# EAGLE design triple8_v3 (EAGLE 5.06)
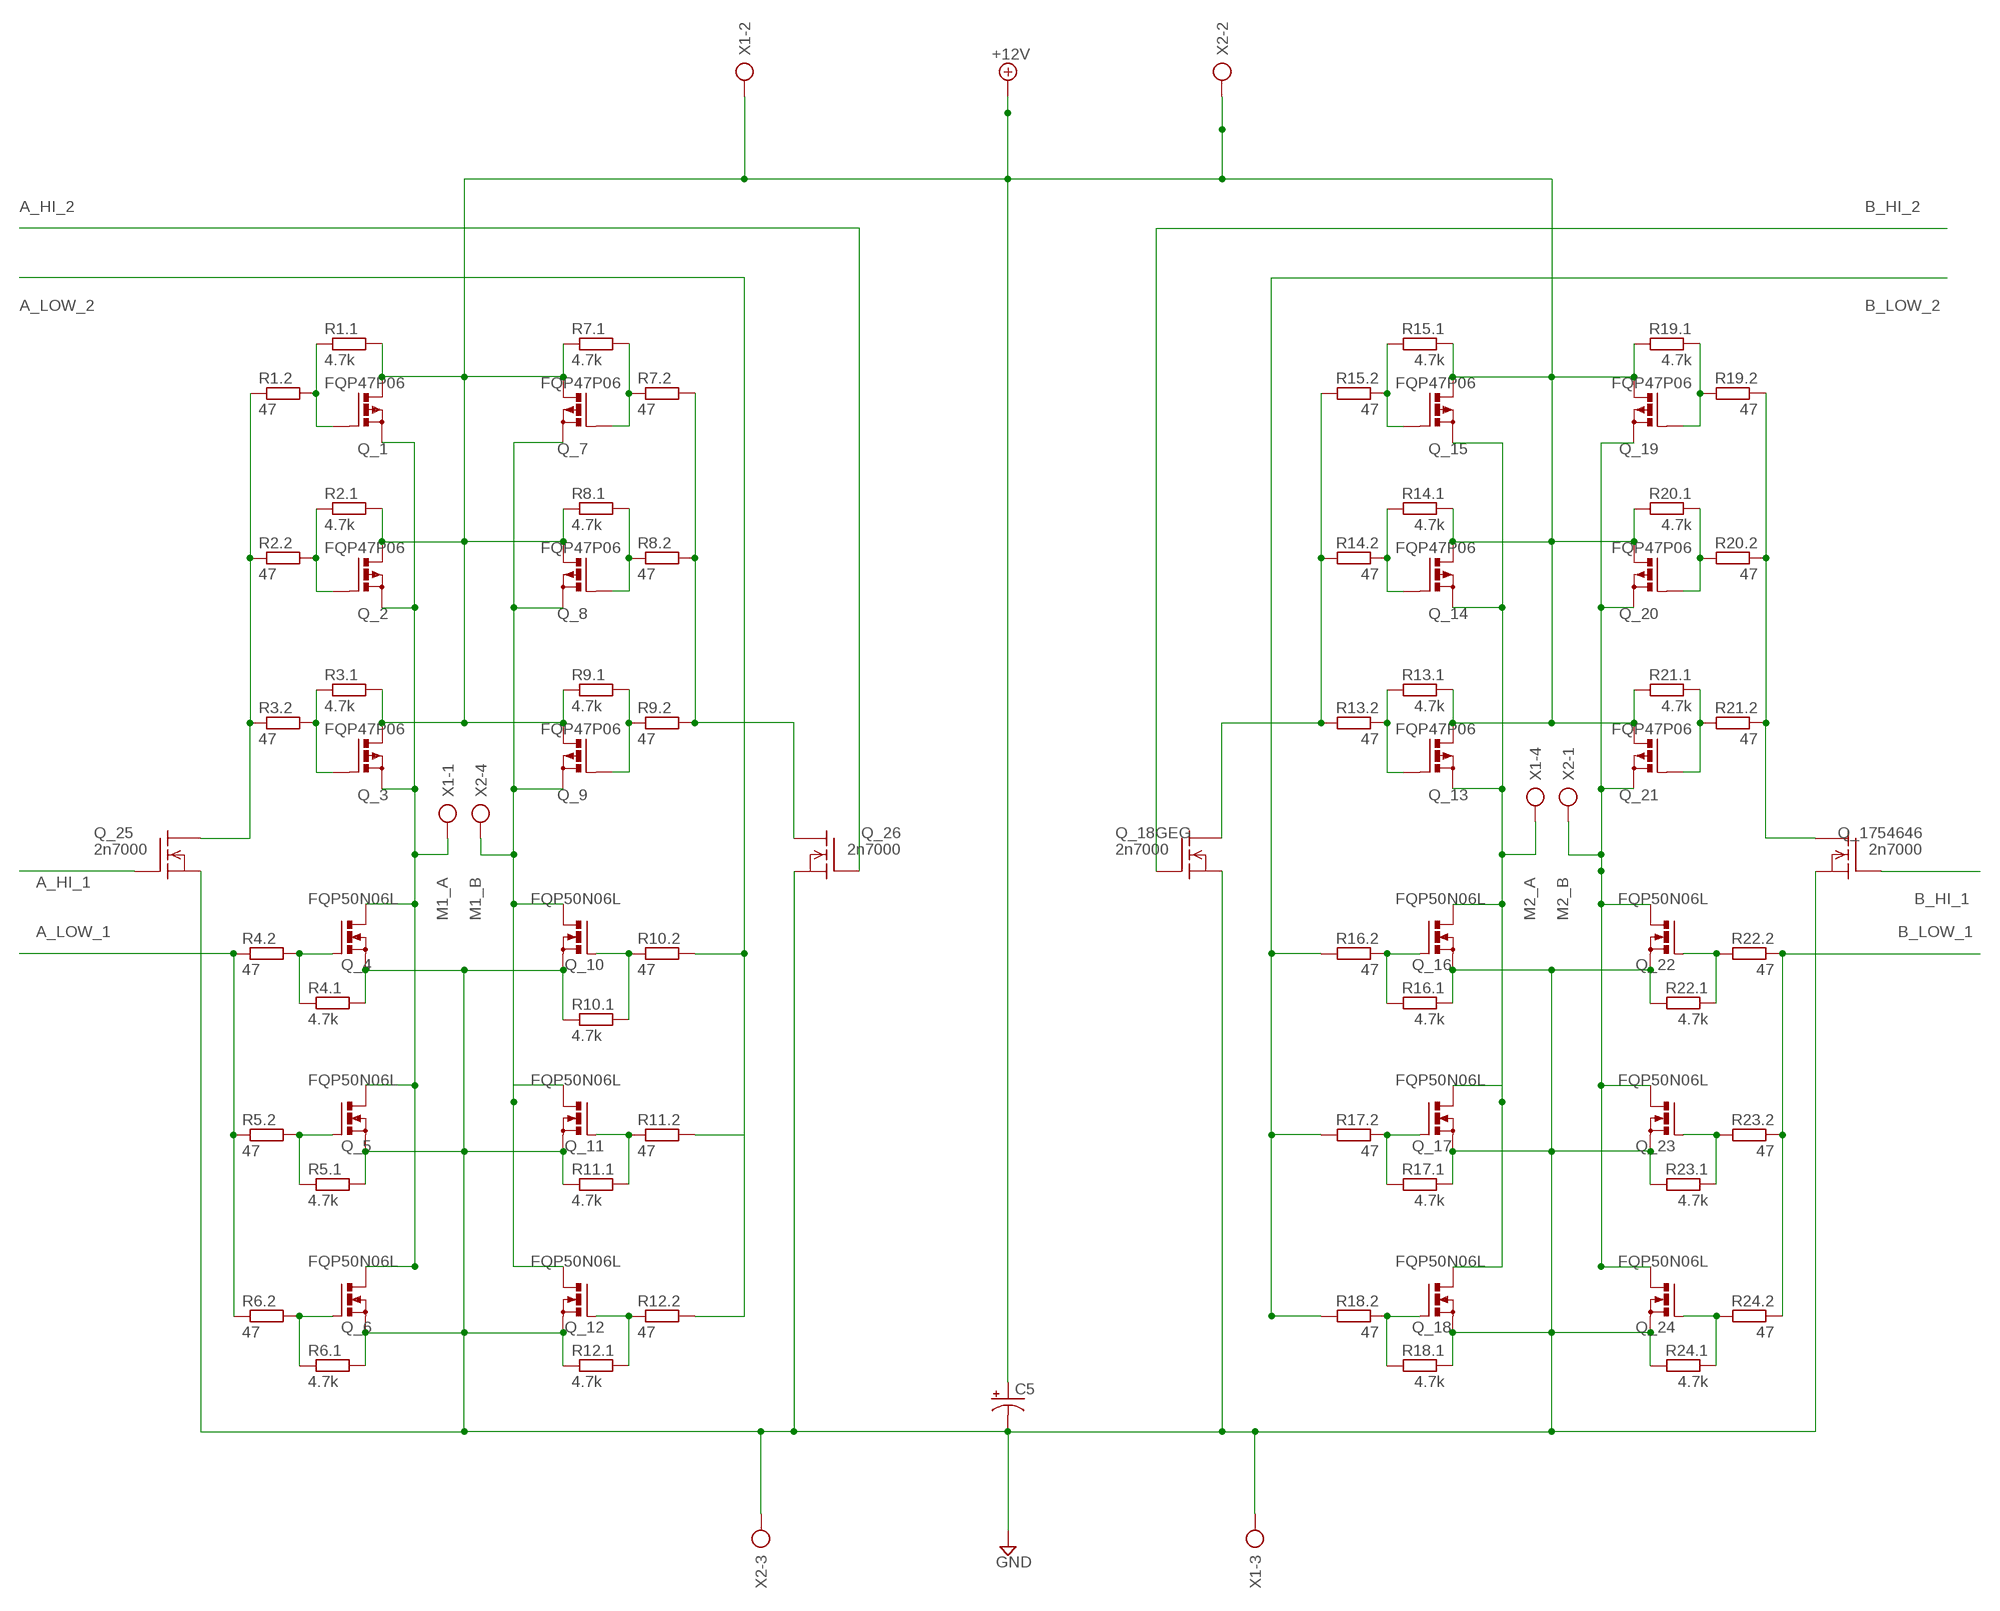
[diagram p0: schematic, sheet 1]

## Parts
C5  CPOL-USE10-22.5  [EB22,5D]
Q_1  FQP47P06  PMOSFET_PTO220BV  [TO220BV]
Q_2  FQP47P06  PMOSFET_PTO220BV  [TO220BV]
Q_3  FQP47P06  PMOSFET_PTO220BV  [TO220BV]
Q_4  FQP50N06L  PMOSFET_NTO220BV  [TO220BV]
Q_5  FQP50N06L  PMOSFET_NTO220BV  [TO220BV]
Q_6  FQP50N06L  PMOSFET_NTO220BV  [TO220BV]
Q_7  FQP47P06  PMOSFET_PTO220BV  [TO220BV]
Q_8  FQP47P06  PMOSFET_PTO220BV  [TO220BV]
Q_9  FQP47P06  PMOSFET_PTO220BV  [TO220BV]
Q_10  FQP50N06L  PMOSFET_NTO220BV  [TO220BV]
Q_11  FQP50N06L  PMOSFET_NTO220BV  [TO220BV]
Q_12  FQP50N06L  PMOSFET_NTO220BV  [TO220BV]
Q_13  FQP47P06  PMOSFET_PTO220BV  [TO220BV]
Q_14  FQP47P06  PMOSFET_PTO220BV  [TO220BV]
Q_15  FQP47P06  PMOSFET_PTO220BV  [TO220BV]
Q_16  FQP50N06L  PMOSFET_NTO220BV  [TO220BV]
Q_17  FQP50N06L  PMOSFET_NTO220BV  [TO220BV]
Q_18  FQP50N06L  PMOSFET_NTO220BV  [TO220BV]
Q_18GEG  2n7000  BSS101  [TO92]
Q_19  FQP47P06  PMOSFET_PTO220BV  [TO220BV]
Q_20  FQP47P06  PMOSFET_PTO220BV  [TO220BV]
Q_21  FQP47P06  PMOSFET_PTO220BV  [TO220BV]
Q_22  FQP50N06L  PMOSFET_NTO220BV  [TO220BV]
Q_23  FQP50N06L  PMOSFET_NTO220BV  [TO220BV]
Q_24  FQP50N06L  PMOSFET_NTO220BV  [TO220BV]
Q_25  2n7000  BSS101  [TO92]
Q_26  2n7000  BSS101  [TO92]
Q_1754646  2n7000  BSS101  [TO92]
R1.1  4.7k  R-EU_0204/5  [0204/5]
R1.2  47  R-EU_0204/5  [0204/5]
R2.1  4.7k  R-EU_0204/5  [0204/5]
R2.2  47  R-EU_0204/5  [0204/5]
R3.1  4.7k  R-EU_0204/5  [0204/5]
R3.2  47  R-EU_0204/5  [0204/5]
R4.1  4.7k  R-EU_0204/5  [0204/5]
R4.2  47  R-EU_0204/5  [0204/5]
R5.1  4.7k  R-EU_0204/5  [0204/5]
R5.2  47  R-EU_0204/5  [0204/5]
R6.1  4.7k  R-EU_0204/5  [0204/5]
R6.2  47  R-EU_0204/5  [0204/5]
R7.1  4.7k  R-EU_0204/5  [0204/5]
R7.2  47  R-EU_0204/5  [0204/5]
R8.1  4.7k  R-EU_0204/5  [0204/5]
R8.2  47  R-EU_0204/5  [0204/5]
R9.1  4.7k  R-EU_0204/5  [0204/5]
R9.2  47  R-EU_0204/5  [0204/5]
R10.1  4.7k  R-EU_0204/5  [0204/5]
R10.2  47  R-EU_0204/5  [0204/5]
R11.1  4.7k  R-EU_0204/5  [0204/5]
R11.2  47  R-EU_0204/5  [0204/5]
R12.1  4.7k  R-EU_0204/5  [0204/5]
R12.2  47  R-EU_0204/5  [0204/5]
R13.1  4.7k  R-EU_0204/5  [0204/5]
R13.2  47  R-EU_0204/5  [0204/5]
R14.1  4.7k  R-EU_0204/5  [0204/5]
R14.2  47  R-EU_0204/5  [0204/5]
R15.1  4.7k  R-EU_0204/5  [0204/5]
R15.2  47  R-EU_0204/5  [0204/5]
R16.1  4.7k  R-EU_0204/5  [0204/5]
R16.2  47  R-EU_0204/5  [0204/5]
R17.1  4.7k  R-EU_0204/5  [0204/5]
R17.2  47  R-EU_0204/5  [0204/5]
R18.1  4.7k  R-EU_0204/5  [0204/5]
R18.2  47  R-EU_0204/5  [0204/5]
R19.1  4.7k  R-EU_0204/5  [0204/5]
R19.2  47  R-EU_0204/5  [0204/5]
R20.1  4.7k  R-EU_0204/5  [0204/5]
R20.2  47  R-EU_0204/5  [0204/5]
R21.1  4.7k  R-EU_0204/5  [0204/5]
R21.2  47  R-EU_0204/5  [0204/5]
R22.1  4.7k  R-EU_0204/5  [0204/5]
R22.2  47  R-EU_0204/5  [0204/5]
R23.1  4.7k  R-EU_0204/5  [0204/5]
R23.2  47  R-EU_0204/5  [0204/5]
R24.1  4.7k  R-EU_0204/5  [0204/5]
R24.2  47  R-EU_0204/5  [0204/5]
X1  AK500/4  [AK500/4]
X2  AK500/4  [AK500/4]

## Nets
+12V: C5.+ Q_1.S(D) Q_2.S(D) Q_3.S(D) Q_7.S(D) Q_8.S(D) Q_9.S(D) Q_13.S(D) Q_14.S(D) Q_15.S(D) Q_19.S(D) Q_20.S(D) Q_21.S(D) R1.1.2 R2.1.2 R3.1.2 R7.1.1 R8.1.1 R9.1.1 R13.1.1 R14.1.1 R15.1.1 R19.1.2 R20.1.2 R21.1.2 X1.2 X2.2
A_HI_1: Q_25.2(G)
A_HI_2: Q_26.2(G)
A_LOW_1: R4.2.1 R5.2.1 R6.2.1
A_LOW_2: R10.2.2 R11.2.2 R12.2.2
B_HI_1: Q_1754646.2(G)
B_HI_2: Q_18GEG.2(G)
B_LOW_1: R22.2.1 R23.2.1 R24.2.1
B_LOW_2: R16.2.2 R17.2.2 R18.2.2
GND: C5.- Q_4.S Q_5.S Q_6.S Q_10.S Q_11.S Q_12.S Q_16.S Q_17.S Q_18.S Q_18GEG.1(S) Q_22.S Q_23.S Q_24.S Q_25.1(S) Q_26.1(S) Q_1754646.1(S) R4.1.2 R5.1.2 R6.1.2 R10.1.1 R11.1.1 R12.1.1 R16.1.1 R17.1.1 R18.1.1 R22.1.2 R23.1.2 R24.1.2 X1.3 X2.3
M1_A: Q_1.D(S) Q_2.D(S) Q_3.D(S) Q_4.D Q_5.D Q_6.D X1.1
M1_B: Q_7.D(S) Q_8.D(S) Q_9.D(S) Q_10.D Q_11.D Q_12.D X2.4
M2_A: Q_19.D(S) Q_20.D(S) Q_21.D(S) Q_22.D Q_23.D Q_24.D X2.1
M2_B: Q_13.D(S) Q_14.D(S) Q_15.D(S) Q_16.D Q_17.D Q_18.D X1.4
N$1: Q_5.G R5.1.1 R5.2.2
N$2: Q_13.G R13.1.2 R13.2.1
N$3: Q_4.G R4.1.1 R4.2.2
N$5: Q_21.G R21.1.1 R21.2.2
N$6: Q_2.G R2.1.1 R2.2.2
N$7: Q_22.G R22.1.1 R22.2.2
N$8: Q_25.3(D) R1.2.1 R2.2.1 R3.2.1
N$9: Q_16.G R16.1.2 R16.2.1
N$10: Q_3.G R3.1.1 R3.2.2
N$11: Q_9.G R9.1.2 R9.2.1
N$12: Q_20.G R20.1.1 R20.2.2
N$13: Q_19.G R19.1.1 R19.2.2
N$14: Q_1754646.3(D) R19.2.1 R20.2.1 R21.2.1
N$15: Q_14.G R14.1.2 R14.2.1
N$16: Q_15.G R15.1.2 R15.2.1
N$17: Q_18GEG.3(D) R13.2.2 R14.2.2 R15.2.2
N$18: Q_6.G R6.1.1 R6.2.2
N$19: Q_23.G R23.1.1 R23.2.2
N$20: Q_1.G R1.1.1 R1.2.2
N$21: Q_24.G R24.1.1 R24.2.2
N$22: Q_8.G R8.1.2 R8.2.1
N$23: Q_17.G R17.1.2 R17.2.1
N$24: Q_11.G R11.1.2 R11.2.1
N$25: Q_7.G R7.1.2 R7.2.1
N$26: Q_18.G R18.1.2 R18.2.1
N$27: Q_10.G R10.1.2 R10.2.1
N$29: Q_26.3(D) R7.2.2 R8.2.2 R9.2.2
N$31: Q_12.G R12.1.2 R12.2.1

## Library data of the parts
C5 = resistor:CPOL-US: POLARIZED CAPACITOR, American symbol
Q_1-Q_3 Q_7-Q_9 Q_13-Q_15 Q_19-Q_21 = transistor-power2:PMOSFET_P: Power MOSFET P-Channel
Q_4-Q_6 Q_10-Q_12 Q_16-Q_18 Q_22-Q_24 = transistor-power2:PMOSFET_N: Power MOSFET N-Channel
Q_18GEG Q_25 Q_26 Q_1754646 = transistor-fet:BSS101: N-Channel Enhancement MOSFET 200V; 0,16A; 11Ohm
R1.1 R1.2 R2.1 R2.2 R3.1 R3.2 R4.1 R4.2 R5.1 R5.2 R6.1 R6.2 R7.1 R7.2 R8.1 R8.2 R9.1 R9.2 R10.1 R10.2 R11.1 R11.2 R12.1 R12.2 R13.1 R13.2 R14.1 R14.2 R15.1 R15.2 R16.1 R16.2 R17.1 R17.2 R18.1 R18.2 R19.1 R19.2 R20.1 R20.2 R21.1 R21.2 R22.1 R22.2 R23.1 R23.2 R24.1 R24.2 = rcl:R-EU_: RESISTOR, European symbol
X1 X2 = con-ptr500:AK500/4: CONNECTOR

## Board
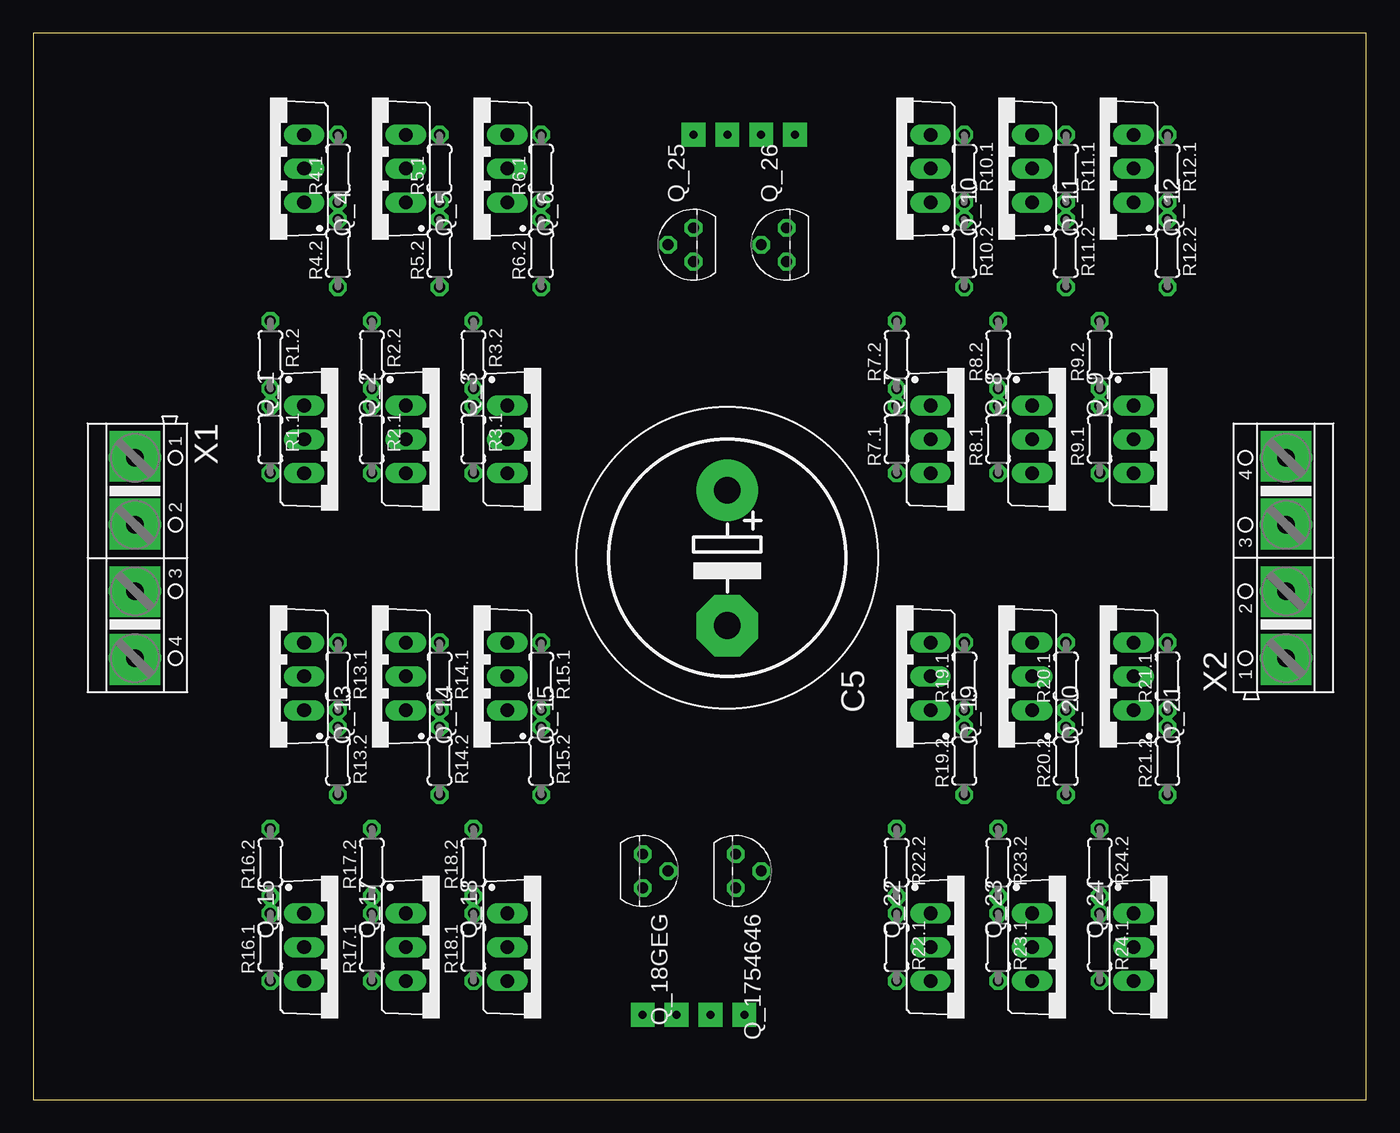
[diagram p1: board, top side]
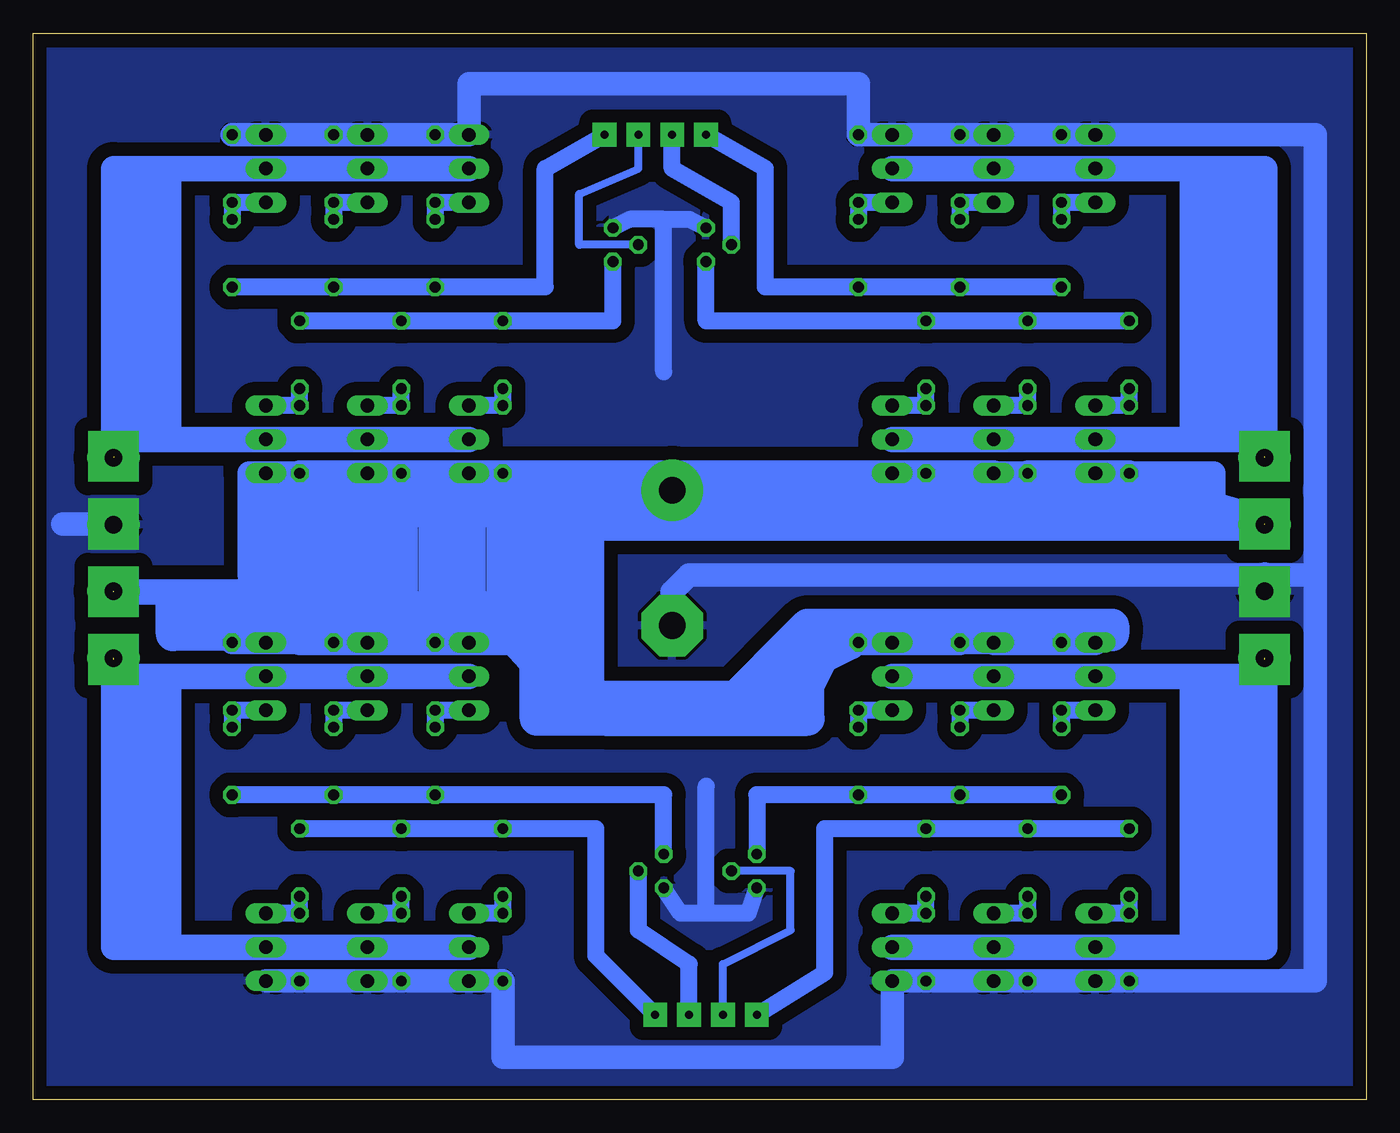
[diagram p2: board, bottom side, seen from below]

Size 100 x 80 mm. Coordinates in mm from the lower left corner, seen from the top.
Outline: 0,0 100,0 100,80 0,80 0,0
Copper layers (1*16): Top 0.035mm / dielectric 1.5mm / Bottom 0.035mm
Design rules "default *": minimum track width 10mil, minimum drill 24mil, track to track 40mil, track to pad 40mil, pad to pad 8mil, via to via 8mil, smd to smd 8mil, copper to edge 40mil, drill to drill 8mil, minimum pad ring 10mil, minimum via ring 8mil, stop-mask expansion 4mil, vias tented up to drill 0mil, thermal gap 10mil

### Footprints (pad centres in the part's own frame; a part is rotated, then mirrored left to right if it is on the bottom)
EB22,5D = drill 2.007 pad 4.597 round: + -5.08,0 | drill 2.007 pad 4.597 octagon: - 5.08,0
TO220BV = drill 1.016 long: D 0,-2.54; G -2.54,-2.54; S 2.54,-2.54
TO92 = drill 0.813 octagon: 1 1.27,0; 2 0,1.905; 3 -1.27,0
0204/5 = drill 0.813 octagon: 1 -2.54,0; 2 2.54,0
AK500/4 = drill 1.321 long: 1 -7.518,0; 2 -2.489,0; 3 2.489,0; 4 7.518,0

### Placement (x,y rotation side)
C5  52.07,40.64 270 top
Q_1  22.86,49.53 270 top
Q_2  30.48,49.53 270 top
Q_3  38.1,49.53 270 top
Q_4  17.78,69.85 90 top
Q_5  25.4,69.85 90 top
Q_6  33.02,69.85 90 top
Q_7  69.85,49.53 270 top
Q_8  77.47,49.53 270 top
Q_9  85.09,49.53 270 top
Q_10  64.77,69.85 90 top
Q_11  72.39,69.85 90 top
Q_12  80.01,69.85 90 top
Q_13  17.78,31.75 90 top
Q_14  25.4,31.75 90 top
Q_15  33.02,31.75 90 top
Q_16  22.86,11.43 270 top
Q_17  30.48,11.43 270 top
Q_18  38.1,11.43 270 top
Q_18GEG  45.72,17.14 270 top
Q_19  64.77,31.75 90 top
Q_20  72.39,31.75 90 top
Q_21  80.01,31.75 90 top
Q_22  69.85,11.43 270 top
Q_23  77.47,11.43 270 top
Q_24  85.09,11.43 270 top
Q_25  49.53,64.14 90 top
Q_26  56.52,64.14 90 top
Q_1754646  52.7,17.14 270 top
R1.1  17.78,49.53 270 top
R1.2  17.78,55.88 270 top
R2.1  25.4,49.53 270 top
R2.2  25.4,55.88 270 top
R3.1  33.02,49.53 270 top
R3.2  33.02,55.88 270 top
R4.1  22.86,69.85 90 top
R4.2  22.86,63.5 90 top
R5.1  30.48,69.85 90 top
R5.2  30.48,63.5 90 top
R6.1  38.1,69.85 90 top
R6.2  38.1,63.5 90 top
R7.1  64.77,49.53 90 top
R7.2  64.77,55.88 90 top
R8.1  72.39,49.53 90 top
R8.2  72.39,55.88 90 top
R9.1  80.01,49.53 90 top
R9.2  80.01,55.88 90 top
R10.1  69.85,69.85 270 top
R10.2  69.85,63.5 270 top
R11.1  77.47,69.85 270 top
R11.2  77.47,63.5 270 top
R12.1  85.09,69.85 270 top
R12.2  85.09,63.5 270 top
R13.1  22.86,31.75 270 top
R13.2  22.86,25.4 270 top
R14.1  30.48,31.75 270 top
R14.2  30.48,25.4 270 top
R15.1  38.1,31.75 270 top
R15.2  38.1,25.4 270 top
R16.1  17.78,11.43 90 top
R16.2  17.78,17.78 90 top
R17.1  25.4,11.43 90 top
R17.2  25.4,17.78 90 top
R18.1  33.02,11.43 90 top
R18.2  33.02,17.78 90 top
R19.1  69.85,31.75 90 top
R19.2  69.85,25.4 90 top
R20.1  77.47,31.75 90 top
R20.2  77.47,25.4 90 top
R21.1  85.09,31.75 90 top
R21.2  85.09,25.4 90 top
R22.1  64.77,11.43 270 top
R22.2  64.77,17.78 270 top
R23.1  72.39,11.43 270 top
R23.2  72.39,17.78 270 top
R24.1  80.01,11.43 270 top
R24.2  80.01,17.78 270 top
X1  7.62,40.64 270 top
X2  93.98,40.64 90 top

### Tracks (layer width: path | path; a pad name or v marks a point on that pad's centre or on a via)
+12V  (via drill 0.6 pad 3.81)  (2 unrouted)
  Bottom 1.778: Q_2.S R2.1.2 | R9.1.1 Q_9.S | R14.1.1 Q_14.S | R21.1.2 Q_21.S 80.01,34.29 | 40.64,34.29 38.73,34.29 R15.1.1 | 78.74,46.99 83.82,46.99 83.82,39.37 82.55,39.37 | 82.55,39.37 81.28,39.37 81.28,45.72 82.55,45.72 82.55,39.37 | R1.1.2 11.43,46.99 11.43,45.09
  Bottom 1.93: R1.1.2 Q_1.S R2.1.2 | Q_2.S R3.1.2 Q_3.S 52.07,46.99 | C5.+ 52.07,46.99 | R15.1.1 Q_15.S R14.1.1 | Q_13.S R13.1.1 Q_14.S | 40.64,34.29 43.18,30.48 58.42,30.48 60.96,30.48 63.5,34.29 Q_19.S R19.1.2 Q_20.S R20.1.2 80.01,34.29 80.01,34.92 80.01,38.1 | 80.01,38.1 R9.1.1 78.74,46.99 Q_8.S R8.1.1 Q_7.S R7.1.1 52.07,46.99 | 80.01,38.1 v93.98,38.1 | v7.62,43.18 52.07,43.18 52.07,44.45
  Bottom 2.54: 41.91,35.56 19.05,35.56 19.05,34.92 25.4,34.92 | 46.99,28.57 41.91,35.56 | 62.23,35.56 57.15,28.57 | 62.23,35.56 64.77,35.56 | 64.77,35.56 78.74,35.56 | 78.74,35.56 78.74,45.72 C5.+ | 16.51,45.72 C5.+ | C5.+ 52.07,44.45 49.53,44.45 | 49.53,44.45 16.51,44.45 16.51,45.72 | 16.51,45.72 v7.62,43.18 62.23,43.18 | 49.53,44.45 77.47,44.45 77.47,36.83 74.93,36.83 74.93,43.18 72.39,43.18 72.39,36.83 69.85,36.83 69.85,43.18 67.31,43.18 67.31,36.83 64.77,36.83 64.77,43.18 62.23,43.18 | 62.23,43.18 62.23,35.56 | 41.91,31.75 41.27,33.02 | 41.27,33.02 40.64,34.29 | 45.72,28.57 41.91,31.75 | 64.77,35.56 58.42,28.57 | 64.77,35.56 57.15,29.21 48.26,29.21 41.91,35.56 | 58.42,30.48 58.42,41.91 60.96,41.91 59.69,40.64 60.96,35.56 59.69,34.29 | 62.23,34.29 62.23,28.57 58.42,28.57 | 45.72,28.57 41.91,28.57 41.91,31.11 | 46.99,28.57 45.72,28.57 | 57.15,28.57 46.99,28.57 | 57.15,28.57 58.42,28.57 | 41.91,31.75 41.91,31.11 | 12.7,44.45 12.7,45.72 16.51,45.72 | 78.74,35.56 80.01,34.92 89.53,34.92 89.53,35.56 | 89.53,35.56 89.53,36.2 81.28,36.2 | 89.53,35.56 89.53,37.47 | 41.27,33.02 38.73,34.29 | 41.27,33.02 40.64,33.66 41.91,31.11
A_HI_1  (via drill 0.6 pad 1.78)
  Bottom 1.27: v52.07,72.39 52.07,69.85 47.62,67.31 Q_25.2
A_HI_2  (via drill 0.6 pad 1.78)
  Bottom 0.61: Q_26.2 59.05,64.14 59.05,67.94 54.61,69.85 v54.61,72.39
A_LOW_1  (via drill 0.6 pad 1.78)
  Bottom 1.27: R4.2.1 R5.2.1 R6.2.1 45.09,60.96 45.09,69.85 v49.53,72.39
A_LOW_2  (via drill 0.6 pad 1.78)
  Bottom 1.016: 62.23,60.96 R10.2.2
  Bottom 1.27: R12.2.2 R11.2.2 62.23,60.96 61.59,60.96 61.59,69.85 v57.15,72.39
B_HI_1  (via drill 0.6 pad 1.78)
  Bottom 1.27: Q_1754646.2 54.61,12.7 50.8,10.16 v50.8,6.35
B_HI_2  (via drill 0.6 pad 1.78)
  Bottom 0.61: Q_18GEG.2 43.18,17.14 43.18,12.7 48.26,10.16 v48.26,6.35
B_LOW_1  (via drill 0.6 pad 1.78)
  Bottom 1.27: R24.2.1 R23.2.1 R22.2.1 57.78,20.32 57.78,10.79 v53.34,6.35
B_LOW_2  (via drill 0.6 pad 1.78)
  Bottom 1.016: 40.64,20.32 R18.2.2
  Bottom 1.27: R16.2.2 R17.2.2 40.64,20.32 40.64,9.53 v45.72,6.35
GND  (via drill 0.6 pad 3.81)
  Bottom 1.27: 49.53,13.97 49.53,23.5 | Q_18GEG.1 46.35,13.97 49.53,13.97 | 49.53,13.97 51.44,13.97 Q_1754646.1 | 52.7,54.61 52.7,66.04 | 52.7,66.04 50.8,66.04 Q_25.1 | Q_26.1 55.24,66.04 52.7,66.04
  Bottom 1.778: R12.1.1 Q_12.S R11.1.1 Q_11.S R10.1.1 Q_10.S 67.31,76.2 38.1,76.2 R6.1.2 Q_6.S R5.1.2 Q_5.S R4.1.2 Q_4.S 3.81,72.39 3.81,39.37 | Q_24.S R24.1.2 Q_23.S R23.1.2 Q_22.S R22.1.2 64.77,3.17 35.56,3.17 Q_18.S R18.1.1 Q_17.S R17.1.1 Q_16.S R16.1.1 3.81,8.89 3.81,39.37 | 3.81,39.37 7.62,39.37 50.8,39.37 52.07,38.1 C5.- | v93.98,43.18 97.79,43.18
  Bottom 1.93: 7.62,39.37 v7.62,38.1
  pour Bottom: 0.64,78.74 99.69,78.74 100.33,-0.64 1.27,-0.64
M1_A  (via drill 0.6 pad 3.81)  (1 unrouted)
  Bottom 1.93: Q_6.D Q_5.D Q_4.D 7.62,69.85 7.62,49.53 | Q_3.D Q_2.D Q_1.D 7.62,49.53 | 7.62,49.53 8.89,49.53 v7.62,48.26
M1_B  (via drill 0.6 pad 3.81)  (1 unrouted)
  Bottom 1.93: Q_10.D Q_11.D 93.98,69.85 | 93.98,69.85 Q_12.D | Q_7.D Q_8.D Q_9.D 93.98,49.53 | 93.98,49.53 93.98,69.85 | 93.98,49.53 92.71,49.53 v93.98,48.26
M2_A  (via drill 0.6 pad 3.81)  (1 unrouted)
  Bottom 0.254: 93.98,31.75 93.98,32.38
  Bottom 1.93: Q_22.D Q_23.D Q_24.D 93.98,11.43 93.98,31.75 | Q_19.D Q_20.D Q_21.D 93.98,31.75 | 93.98,31.75 92.71,31.75 v93.98,33.02
M2_B  (via drill 0.6 pad 3.81)  (1 unrouted)
  Bottom 0.254: 22.86,11.43 Q_16.D
  Bottom 1.93: Q_18.D Q_17.D 22.86,11.43 7.62,11.43 7.62,31.11 7.62,31.75 | Q_15.D Q_14.D Q_13.D 7.62,31.75 | 7.62,31.75 8.89,31.75 v7.62,33.02
N$1
  Bottom 1.27: R5.2.2 R5.1.1 Q_5.G
N$2
  Bottom 1.27: R13.2.1 R13.1.2 Q_13.G
N$3
  Bottom 1.27: R4.2.2 R4.1.1 Q_4.G
N$5
  Bottom 1.27: R21.2.2 R21.1.1 Q_21.G
N$6
  Bottom 1.27: R2.2.2 R2.1.1 Q_2.G
N$7
  Bottom 1.27: R22.2.2 R22.1.1 Q_22.G
N$8
  Bottom 1.27: R1.2.1 R2.2.1 R3.2.1 49.53,58.42 Q_25.3
N$9
  Bottom 1.27: R16.2.1 R16.1.2 Q_16.G
N$10
  Bottom 1.27: R3.2.2 R3.1.1 Q_3.G
N$11
  Bottom 1.27: R9.2.1 R9.1.2 Q_9.G
N$12
  Bottom 1.27: R20.2.2 R20.1.1 Q_20.G
N$13
  Bottom 1.27: R19.2.2 R19.1.1 Q_19.G
N$14
  Bottom 1.27: Q_1754646.3 52.7,22.86 R19.2.1 R20.2.1 R21.2.1
N$15
  Bottom 1.27: R14.2.1 R14.1.2 Q_14.G
N$16
  Bottom 1.27: R15.2.1 R15.1.2 Q_15.G
N$17
  Bottom 1.016: 45.72,22.86 R15.2.2
  Bottom 1.27: R13.2.2 R14.2.2 45.72,22.86 Q_18GEG.3
N$18
  Bottom 1.27: R6.2.2 R6.1.1 Q_6.G
N$19
  Bottom 1.27: R23.2.2 R23.1.1 Q_23.G
N$20
  Bottom 1.27: R1.2.2 R1.1.1 Q_1.G
N$21
  Bottom 1.27: R24.2.2 R24.1.1 Q_24.G
N$22
  Bottom 1.27: R8.2.1 R8.1.2 Q_8.G
N$23
  Bottom 1.27: R17.2.1 R17.1.2 Q_17.G
N$24
  Bottom 1.27: R11.2.1 R11.1.2 Q_11.G
N$25
  Bottom 1.27: R7.2.1 R7.1.2 Q_7.G
N$26
  Bottom 1.27: R18.2.1 R18.1.2 Q_18.G
N$27
  Bottom 1.27: R10.2.1 R10.1.2 Q_10.G
N$29
  Bottom 1.27: 56.52,58.42 R8.2.2 R9.2.2 | 56.52,58.42 R7.2.2 | 56.52,58.42 Q_26.3
N$31
  Bottom 1.27: R12.2.1 R12.1.2 Q_12.G
(copper drawn outside any net)
  shapes: Bottom area x4